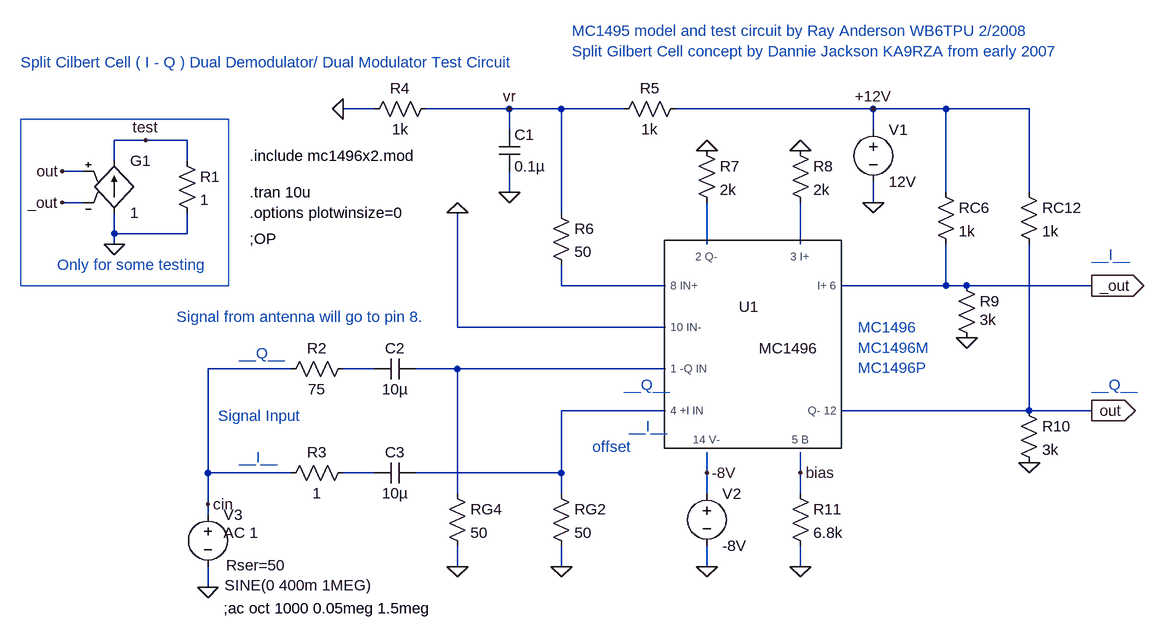
[diagram p0: schematic MC1496_split_Gilbert_Cell_Test.asc]
MC1496_split_Gilbert_Cell_Test.asc, the LTspice schematic file:
Version 4
SHEET 1 1672 1236
WIRE -752 -256 -800 -256
WIRE -544 -256 -672 -256
WIRE -464 -256 -544 -256
WIRE -368 -256 -464 -256
WIRE 16 -256 -288 -256
WIRE 128 -256 16 -256
WIRE 256 -256 128 -256
WIRE -544 -224 -544 -256
WIRE 16 -224 16 -256
WIRE -1104 -208 -1152 -208
WIRE -1040 -208 -1104 -208
WIRE -1152 -176 -1152 -208
WIRE -1040 -176 -1040 -208
WIRE -1200 -160 -1232 -160
WIRE -544 -128 -544 -160
WIRE 128 -128 128 -256
WIRE 256 -128 256 -256
WIRE -1200 -112 -1232 -112
WIRE 16 -112 16 -144
WIRE -464 -96 -464 -256
WIRE -1152 -64 -1152 -96
WIRE -1040 -64 -1040 -96
WIRE -1040 -64 -1152 -64
WIRE -1152 -48 -1152 -64
WIRE -240 -48 -240 -112
WIRE -96 -48 -96 -112
WIRE -464 16 -464 -16
WIRE -304 16 -464 16
WIRE 128 16 128 -48
WIRE 128 16 -32 16
WIRE 160 16 128 16
WIRE 352 16 160 16
WIRE -624 80 -624 -96
WIRE -304 80 -624 80
WIRE -880 144 -1008 144
WIRE -752 144 -800 144
WIRE -624 144 -688 144
WIRE -304 144 -624 144
WIRE -304 208 -464 208
WIRE 256 208 256 -48
WIRE 256 208 -32 208
WIRE 352 208 256 208
WIRE -1008 304 -1008 144
WIRE -880 304 -1008 304
WIRE -752 304 -800 304
WIRE -464 304 -464 208
WIRE -464 304 -688 304
WIRE -240 304 -240 272
WIRE -96 304 -96 272
WIRE -624 336 -624 144
WIRE -464 336 -464 304
WIRE -240 336 -240 304
WIRE -96 336 -96 304
WIRE -1008 352 -1008 304
WIRE -1008 368 -1008 352
WIRE -624 448 -624 416
WIRE -464 448 -464 416
WIRE -240 448 -240 416
WIRE -96 448 -96 416
WIRE -1008 480 -1008 448
FLAG 16 -112 0
FLAG -240 448 0
FLAG -240 304 -8V
FLAG 16 -256 +12V
FLAG -624 448 0
FLAG -544 -256 vr
FLAG -1008 480 0
FLAG -1152 -48 0
FLAG -1104 -208 test
FLAG -1232 -112 _out
FLAG -1232 -160 out
FLAG -96 448 0
FLAG -464 448 0
FLAG -800 -256 0
FLAG -544 -128 0
FLAG 352 16 _out
IOPIN 352 16 Out
FLAG 352 208 out
IOPIN 352 208 Out
FLAG -96 304 bias
FLAG -1008 352 cin
FLAG -96 -192 0
FLAG -240 -192 0
FLAG 160 96 0
FLAG 256 288 0
FLAG -624 -96 0
SYMBOL voltage 16 -240 R0
WINDOW 123 0 0 Left 0
WINDOW 39 0 0 Left 0
SYMATTR InstName V1
SYMATTR Value 12V
SYMBOL voltage -240 320 R0
WINDOW 123 0 0 Left 0
WINDOW 39 0 0 Left 0
SYMATTR InstName V2
SYMATTR Value -8V
SYMBOL res -640 320 R0
SYMATTR InstName RG4
SYMATTR Value 50
SYMBOL res 112 -144 R0
SYMATTR InstName RC6
SYMATTR Value 1k
SYMBOL res 240 -144 R0
SYMATTR InstName RC12
SYMATTR Value 1k
SYMBOL res -1056 -192 R0
SYMATTR InstName R1
SYMATTR Value 1
SYMBOL g -1152 -192 R0
SYMATTR InstName G1
SYMATTR Value 1
SYMBOL res -112 320 R0
SYMATTR InstName R11
SYMATTR Value 6.8k
SYMBOL res -480 320 R0
SYMATTR InstName RG2
SYMATTR Value 50
SYMBOL voltage -1008 352 R0
WINDOW 3 26 125 Left 0
WINDOW 123 24 44 Left 0
WINDOW 39 28 94 Left 0
SYMATTR Value SINE(0 400m 1MEG)
SYMATTR Value2 AC 1
SYMATTR SpiceLine Rser=50
SYMATTR InstName V3
SYMBOL res -384 -240 R270
WINDOW 0 32 56 VTop 0
WINDOW 3 0 56 VBottom 0
SYMATTR InstName R5
SYMATTR Value 1k
SYMBOL res -768 -240 R270
WINDOW 0 32 56 VTop 0
WINDOW 3 0 56 VBottom 0
SYMATTR InstName R4
SYMATTR Value 1k
SYMBOL res -480 -112 R0
SYMATTR InstName R6
SYMATTR Value 50
SYMBOL cap -560 -224 R0
SYMATTR InstName C1
SYMATTR Value 0.1µ
SYMBOL cap -752 320 R270
WINDOW 0 32 32 VTop 0
WINDOW 3 0 32 VBottom 0
SYMATTR InstName C3
SYMATTR Value 10µ
SYMBOL mc1496 -160 112 R0
SYMATTR InstName U1
SYMBOL res -256 -208 R0
SYMATTR InstName R7
SYMATTR Value 2k
SYMBOL res -112 -208 R0
SYMATTR InstName R8
SYMATTR Value 2k
SYMBOL res 144 0 R0
WINDOW 3 36 68 Left 0
SYMATTR Value 3k
SYMATTR InstName R9
SYMBOL res 240 192 R0
SYMATTR InstName R10
SYMATTR Value 3k
SYMBOL cap -752 160 R270
WINDOW 0 32 32 VTop 0
WINDOW 3 0 32 VBottom 0
SYMATTR InstName C2
SYMATTR Value 10µ
SYMBOL res -784 128 R90
WINDOW 0 0 56 VBottom 0
WINDOW 3 32 56 VTop 0
SYMATTR InstName R2
SYMATTR Value 75
SYMBOL res -784 288 R90
WINDOW 0 0 56 VBottom 0
WINDOW 3 32 56 VTop 0
SYMATTR InstName R3
SYMATTR Value 1
TEXT -992 216 Left 0 ;Signal Input
TEXT -944 -128 Left 0 !.tran 10u
TEXT -944 -56 Left 0 !;OP
TEXT -944 -96 Left 0 !.options plotwinsize=0
TEXT -944 -184 Left 0 !.include mc1496x2.mod
TEXT -416 264 Left 0 ;offset
TEXT -8 80 Left 0 ;MC1496\nMC1496M\nMC1496P
TEXT -1240 -16 Left 0 ;Only for some testing
TEXT -984 512 Left 0 !;ac oct 1000 0.05meg 1.5meg
TEXT -1056 64 Left 0 ;Signal from antenna will go to pin 8.
TEXT 352 -32 Left 0 ;__I__
TEXT 352 168 Left 0 ;__Q__
TEXT -960 280 Left 0 ;__I__
TEXT -960 120 Left 0 ;__Q__
TEXT -360 232 Left 0 ;__I__
TEXT -368 168 Left 0 ;__Q__
TEXT -448 -376 Left 0 ;MC1495 model and test circuit by Ray Anderson WB6TPU 2/2008\nSplit Gilbert Cell concept by Dannie Jackson KA9RZA from early 2007
TEXT -1296 -328 Left 0 ;Split Cilbert Cell ( I - Q ) Dual Demodulator/ Dual Modulator Test Circuit
RECTANGLE Normal -976 16 -1296 -240

The netlist it stands for:
* MC1496_split_Gilbert_Cell_Test.asc
V1 +12V 0 12V
V2 -8V 0 -8V
RG4 N005 0 50
RC6 +12V _out 1k
RC12 +12V out 1k
R1 test 0 1
G1 0 test out _out 1
R11 bias 0 6.8k
RG2 N006 0 50
V3 cin 0 SINE(0 400m 1MEG) AC 1 Rser=50
R5 vr +12V 1k
R4 0 vr 1k
R6 vr N003 50
C1 vr 0 0.1µ
C3 N007 N006 10µ
XU1 N003 0 N005 N006 N001 N002 -8V bias _out out MC1496  ; pins 8_IN+ 10_IN- 1_-Q_IN 4_+I_IN 2_Q- 3_I+ 14_V- 5_B I+_6 Q-_12
R7 0 N001 2k
R8 0 N002 2k
R9 _out 0 3k
R10 out 0 3k
C2 N004 N005 10µ
R2 N004 cin 75
R3 N007 cin 1
* Signal Input
.tran 10u
;OP
.options plotwinsize=0
.include mc1496x2.mod
* offset
* MC1496
* MC1496M
* MC1496P
* Only for some testing
;ac oct 1000 0.05meg 1.5meg
* Signal from antenna will go to pin 8.
* __I__
* __Q__
* __I__
* __Q__
* __I__
* __Q__
* MC1495 model and test circuit by Ray Anderson WB6TPU 2/2008
* Split Gilbert Cell concept by Dannie Jackson KA9RZA from early 2007
* Split Cilbert Cell ( I - Q ) Dual Demodulator/ Dual Modulator Test Circuit
.backanno
.end